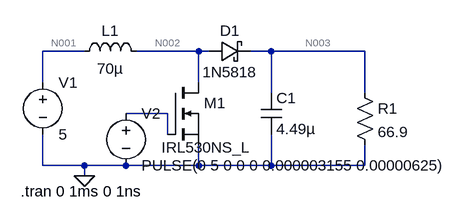
[diagram p0: schematic Boost Coverter.asc]
Boost Coverter.asc, the LTspice schematic file:
Version 4
SHEET 1 880 680
WIRE 288 240 224 240
WIRE 464 240 368 240
WIRE 480 240 464 240
WIRE 576 240 544 240
WIRE 720 240 576 240
WIRE 224 288 224 240
WIRE 464 288 464 240
WIRE 576 304 576 240
WIRE 720 304 720 240
WIRE 416 336 352 336
WIRE 416 368 416 336
WIRE 224 416 224 368
WIRE 288 416 224 416
WIRE 352 416 288 416
WIRE 464 416 464 384
WIRE 464 416 352 416
WIRE 576 416 576 368
WIRE 576 416 464 416
WIRE 720 416 720 384
WIRE 720 416 576 416
WIRE 288 432 288 416
FLAG 288 432 0
SYMBOL ind 272 256 R270
WINDOW 0 32 56 VTop 2
WINDOW 3 5 56 VBottom 2
SYMATTR InstName L1
SYMATTR Value 70µ
SYMBOL cap 560 304 R0
SYMATTR InstName C1
SYMATTR Value 4.49µ
SYMBOL res 704 288 R0
SYMATTR InstName R1
SYMATTR Value 66.9
SYMBOL schottky 480 256 R270
WINDOW 0 32 32 VTop 2
WINDOW 3 0 32 VBottom 2
SYMATTR InstName D1
SYMATTR Value 1N5818
SYMATTR Description Diode
SYMATTR Type diode
SYMBOL nmos 416 288 R0
WINDOW 3 -9 100 Left 2
SYMATTR InstName M1
SYMATTR Value IRL530NS_L
SYMBOL voltage 224 272 R0
SYMATTR InstName V1
SYMATTR Value 5
SYMBOL voltage 352 320 R0
WINDOW 123 0 0 Left 0
WINDOW 39 0 0 Left 0
SYMATTR InstName V2
SYMATTR Value PULSE(0 5 0 0 0 0.000003155 0.00000625)
TEXT 190 456 Left 2 !.tran 0 1ms 0 1ns

The netlist it stands for:
* Boost Coverter.asc
L1 N001 N002 70µ
C1 N003 0 4.49µ
R1 N003 0 66.9
D1 N002 N003 1N5818
M1 N002 N004 0 0 IRL530NS_L
V1 N001 0 5
V2 N004 0 PULSE(0 5 0 0 0 0.000003155 0.00000625)
.model D D
.lib standard.dio
.model NMOS NMOS
.model PMOS PMOS
.lib standard.mos
.tran 0 1ms 0 1ns
.backanno
.end

* Results of the author's LTspice run, read from the files saved beside the schematic
* Operating Point, zero values left out:
*   V(n001) = 5 V
*   V(n002) = 5 V
*   V(n003) = 4.723 V
*   Id(M1) = 72.99 pA
*   Is(M1) = -72.99 pA
*   I(D1) = 70.59 mA
*   I(L1) = 70.59 mA
*   I(R1) = 70.59 mA
*   I(V1) = -70.59 mA